# EAGLE design cc2540 (EAGLE 6.5.0)
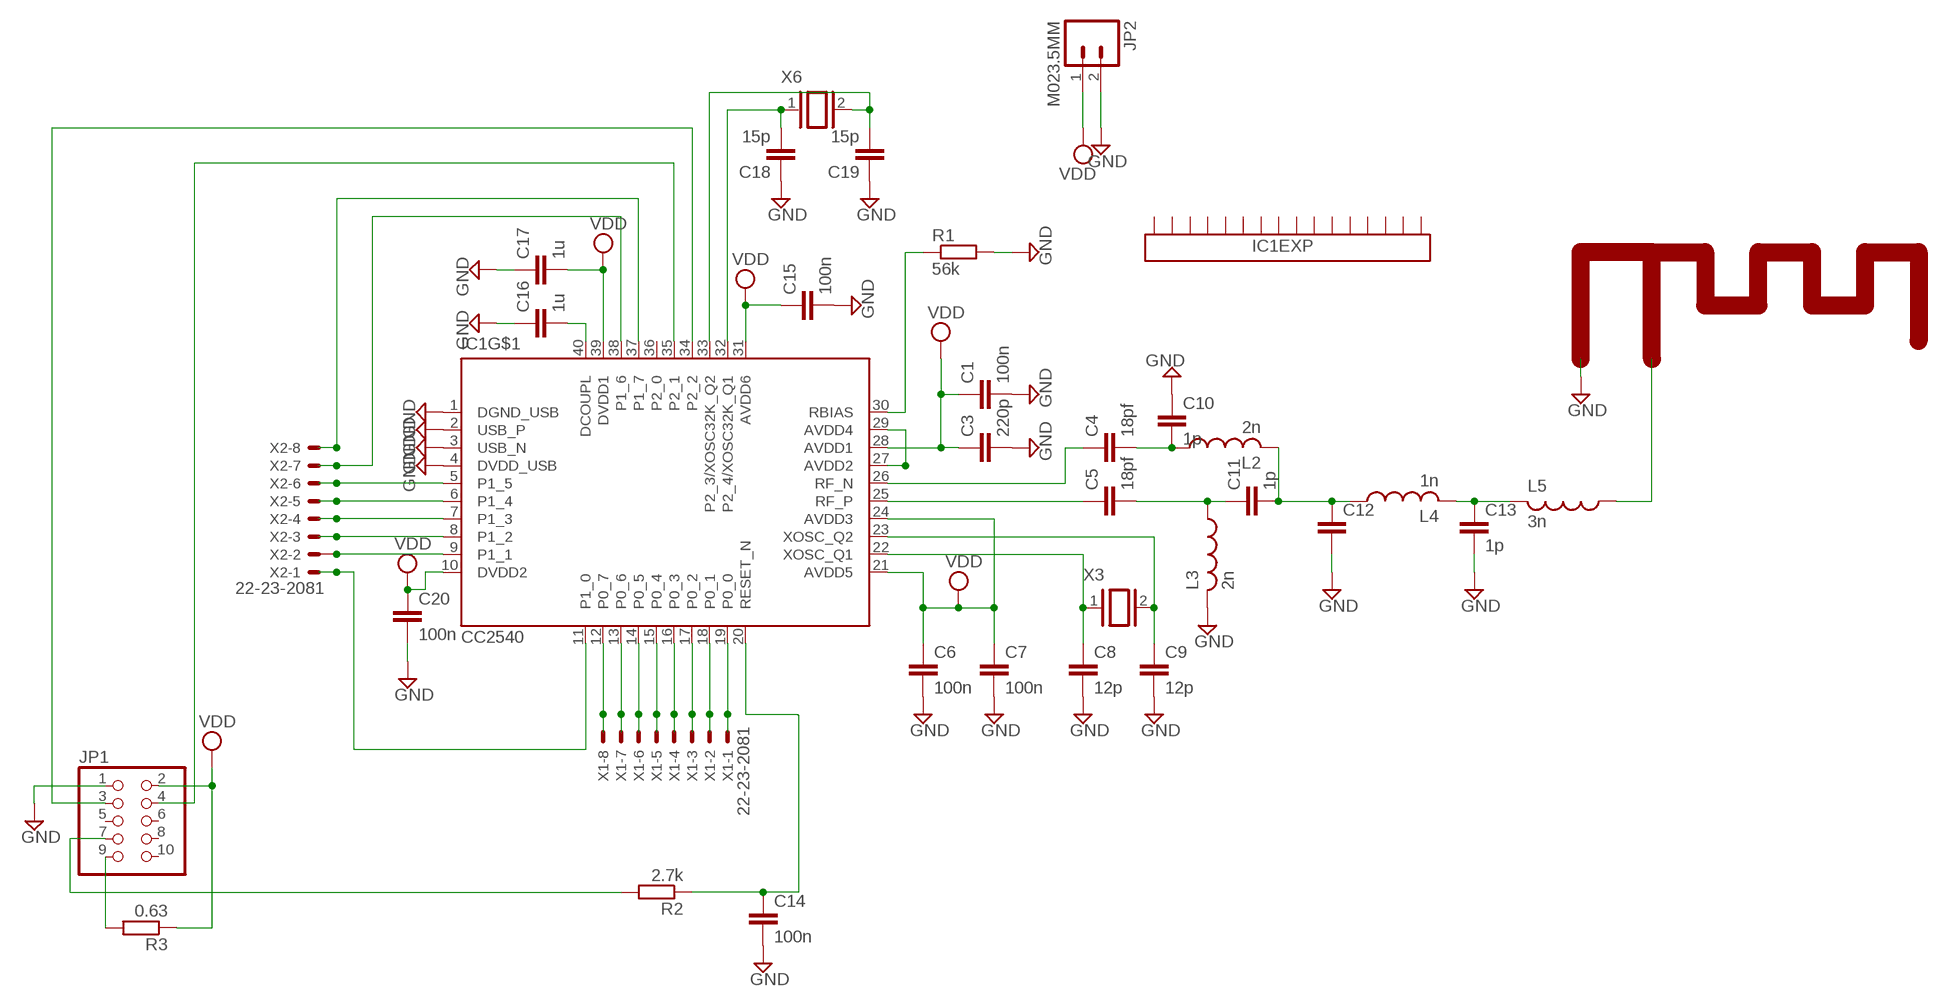
[diagram p0: schematic, sheet 1]

## Parts
A1  TI_2.4GHZ_MIFALEFT  [TI_2.4GHZ_MIFA_LEFT]
C1  100n  C-EU025-025X050  [C025-025X050]
C3  220p  C-EU025-025X050  [C025-025X050]
C4  18pf  C-EU025-025X050  [C025-025X050]
C5  18pf  C-EU025-025X050  [C025-025X050]
C6  100n  C-EU025-025X050  [C025-025X050]
C7  100n  C-EU025-025X050  [C025-025X050]
C8  12p  C-EU025-025X050  [C025-025X050]
C9  12p  C-EU025-025X050  [C025-025X050]
C10  1p  C-EU025-025X050  [C025-025X050]
C11  1p  C-EU025-025X050  [C025-025X050]
C12  C-EU025-025X050  [C025-025X050]
C13  1p  C-EU025-025X050  [C025-025X050]
C14  100n  C-EU025-025X050  [C025-025X050]
C15  100n  C-EU025-025X050  [C025-025X050]
C16  1u  C-EU025-025X050  [C025-025X050]
C17  1u  C-EU025-025X050  [C025-025X050]
C18  15p  C-EU025-025X050  [C025-025X050]
C19  15p  C-EU025-025X050  [C025-025X050]
C20  100n  C-EU025-025X050  [C025-025X050]
IC1  CC2540  [QFN40-6X6]
JP1  PINHD-2X51.27_SMD  [2X05_1.27_SMD]
JP2  M023.5MM  [SCREWTERMINAL-3.5MM-2]
L2  2n  L-US0204/5  [0204/5]
L3  2n  L-US0204/5  [0204/5]
L4  1n  L-US0204/5  [0204/5]
L5  3n  L-US0204/5  [0204/5]
R1  56k  R-EU_0204/2V  [0204V]
R2  2.7k  R-EU_0204/2V  [0204V]
R3  0.63  R-EU_0204/2V  [0204V]
X1  22-23-2081  [22-23-2081]
X2  22-23-2081  [22-23-2081]
X3  XTAL/S  [QS]
X6  XTAL/S  [QS]

## Nets
GND: A1.GND C1.2 C3.2 C6.2 C7.2 C8.2 C9.2 C10.1 C12.2 C13.2 C14.2 C15.2 C16.1 C17.1 C18.1 C19.1 C20.2 IC1.1(DGND_USB) IC1.2(USB_P) IC1.3(USB_N) IC1.4(DVDD_USB) JP1.1 JP2.2 L3.2 R1.2
N$1: IC1.30(RBIAS) R1.1
N$2: C4.1 IC1.26(RF_N)
N$3: C5.1 IC1.25(RF_P)
N$4: C8.1 IC1.22(XOSC_Q1) X3.1
N$5: C9.1 IC1.23(XOSC_Q2) X3.2
N$6: C4.2 C10.2 L2.1
N$7: C5.2 C11.1 L3.1
N$8: C11.2 C12.1 L2.2 L4.1
N$9: C13.1 L4.2 L5.2
N$10: IC1.19(P0_0) X1.1
N$11: IC1.18(P0_1) X1.2
N$12: IC1.17(P0_2) X1.3
N$13: IC1.16(P0_3) X1.4
N$14: IC1.15(P0_4) X1.5
N$15: IC1.14(P0_5) X1.6
N$16: IC1.13(P0_6) X1.7
N$17: IC1.12(P0_7) X1.8
N$18: IC1.27(AVDD2) IC1.29(AVDD4)
N$19: IC1.9(P1_1) X2.2
N$20: IC1.8(P1_2) X2.3
N$21: IC1.7(P1_3) X2.4
N$22: IC1.6(P1_4) X2.5
N$23: IC1.5(P1_5) X2.6
N$24: IC1.38(P1_6) X2.7
N$29: C19.2 IC1.33(P2_3/XOSC32K_Q2) X6.2
N$30: C18.2 IC1.32(P2_4/XOSC32K_Q1) X6.1
N$31: C14.1 IC1.20(RESET_N) R2.1
N$32: IC1.37(P1_7) X2.8
N$34: C16.2 IC1.40(DCOUPL)
N$35: A1.FEED L5.1
N$36: JP1.7 R2.2
N$37: JP1.9 R3.2
N$38: IC1.34(P2_2) JP1.3
N$39: IC1.35(P2_1) JP1.4
N$40: IC1.11(P1_0) X2.1
VDD: C1.1 C3.1 C6.1 C7.1 C15.1 C17.2 C20.1 IC1.10(DVDD2) IC1.21(AVDD5) IC1.24(AVDD3) IC1.28(AVDD1) IC1.31(AVDD6) IC1.39(DVDD1) JP1.2 JP2.1 R3.1
Unconnected: IC1.36(P2_0) IC1.EXP@1(EXP:EXP16) IC1.EXP@2(EXP:EXP16) IC1.EXP@3(EXP:EXP16) IC1.EXP@4(EXP:EXP16) IC1.EXP@5(EXP:EXP16) IC1.EXP@6(EXP:EXP16) IC1.EXP@7(EXP:EXP16) IC1.EXP@8(EXP:EXP16) IC1.EXP@9(EXP:EXP16) IC1.EXP@10(EXP:EXP16) IC1.EXP@11(EXP:EXP16) IC1.EXP@12(EXP:EXP16) IC1.EXP@13(EXP:EXP16) IC1.EXP@14(EXP:EXP16) IC1.EXP@15(EXP:EXP16) IC1.EXP@16(EXP:EXP16) JP1.5 JP1.6 JP1.8 JP1.10

## Library data of the parts
A1 = antennas:TI_2.4GHZ_MIFA
C1 C3-C20 = resistor:C-EU: CAPACITOR, European symbol
IC1 = texas:CC2540: 2.4-GHz Bluetooth® low energy System-on-Chip Auto generated by make-symbol-device-package-bsdl.ulp Rev. 39 Source: cc2540.txt
JP1 = pinhead:PINHD-2X5: PIN HEADER
JP2 = SparkFun-Connectors:M02: Standard 2-pin 0.1" header. Use with - straight break away headers ( PRT-00116) - right angle break away headers (PRT-00553) - swiss pins (PRT-00743) - machine pins (PRT-00117) - female headers (PRT-00115) Molex polarized connector foot print use with: PRT-08233 with associated crimp pins and housings. 2.54_SCREWTERM for use with PRT-10571. 3.5mm Screw Terminal footprints for PRT-08084 5mm Screw Terminal footprints for use with PRT-08433
L2-L5 = resistor:L-US: INDUCTOR, American symbol
R1-R3 = resistor:R-EU_: RESISTOR, European symbol
X1 X2 = con-molex:22-23-2081: .100" (2.54mm) Center Header - 8 Pin; MF: MOLEX; MPN: 22-23-2081; OC_FARNELL: 1756826; OC_NEWARK: 01C7592
X3 X6 = special:XTAL/S: CRYSTAL

## Board
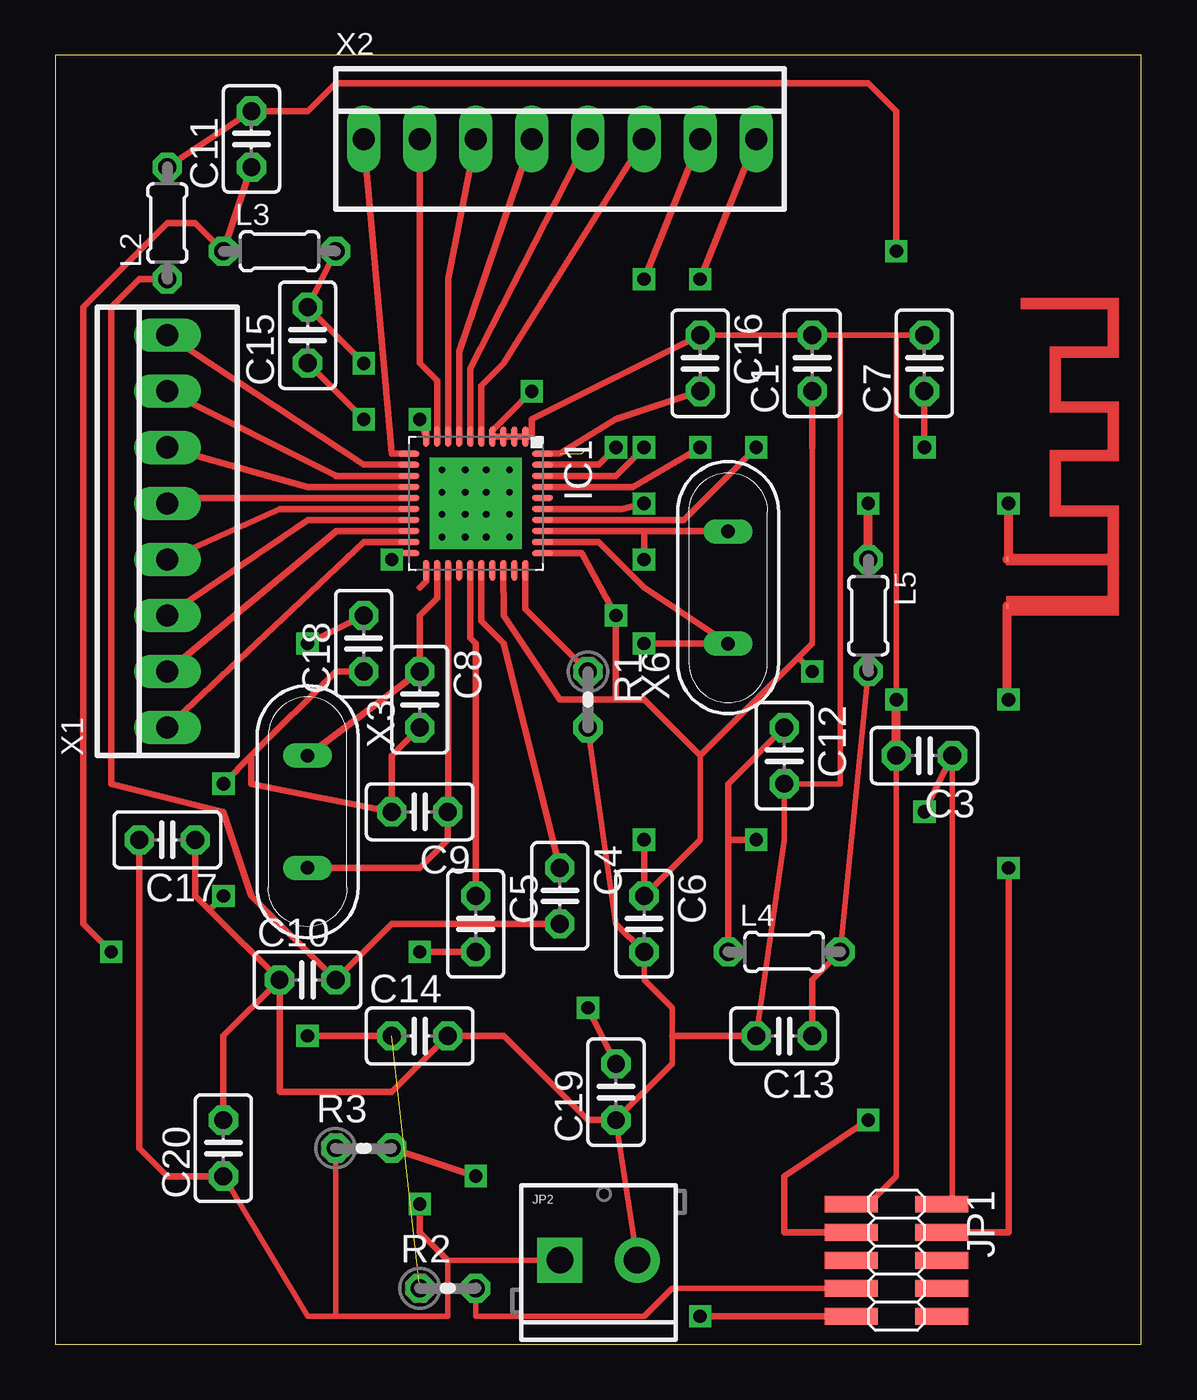
[diagram p1: board, top side]
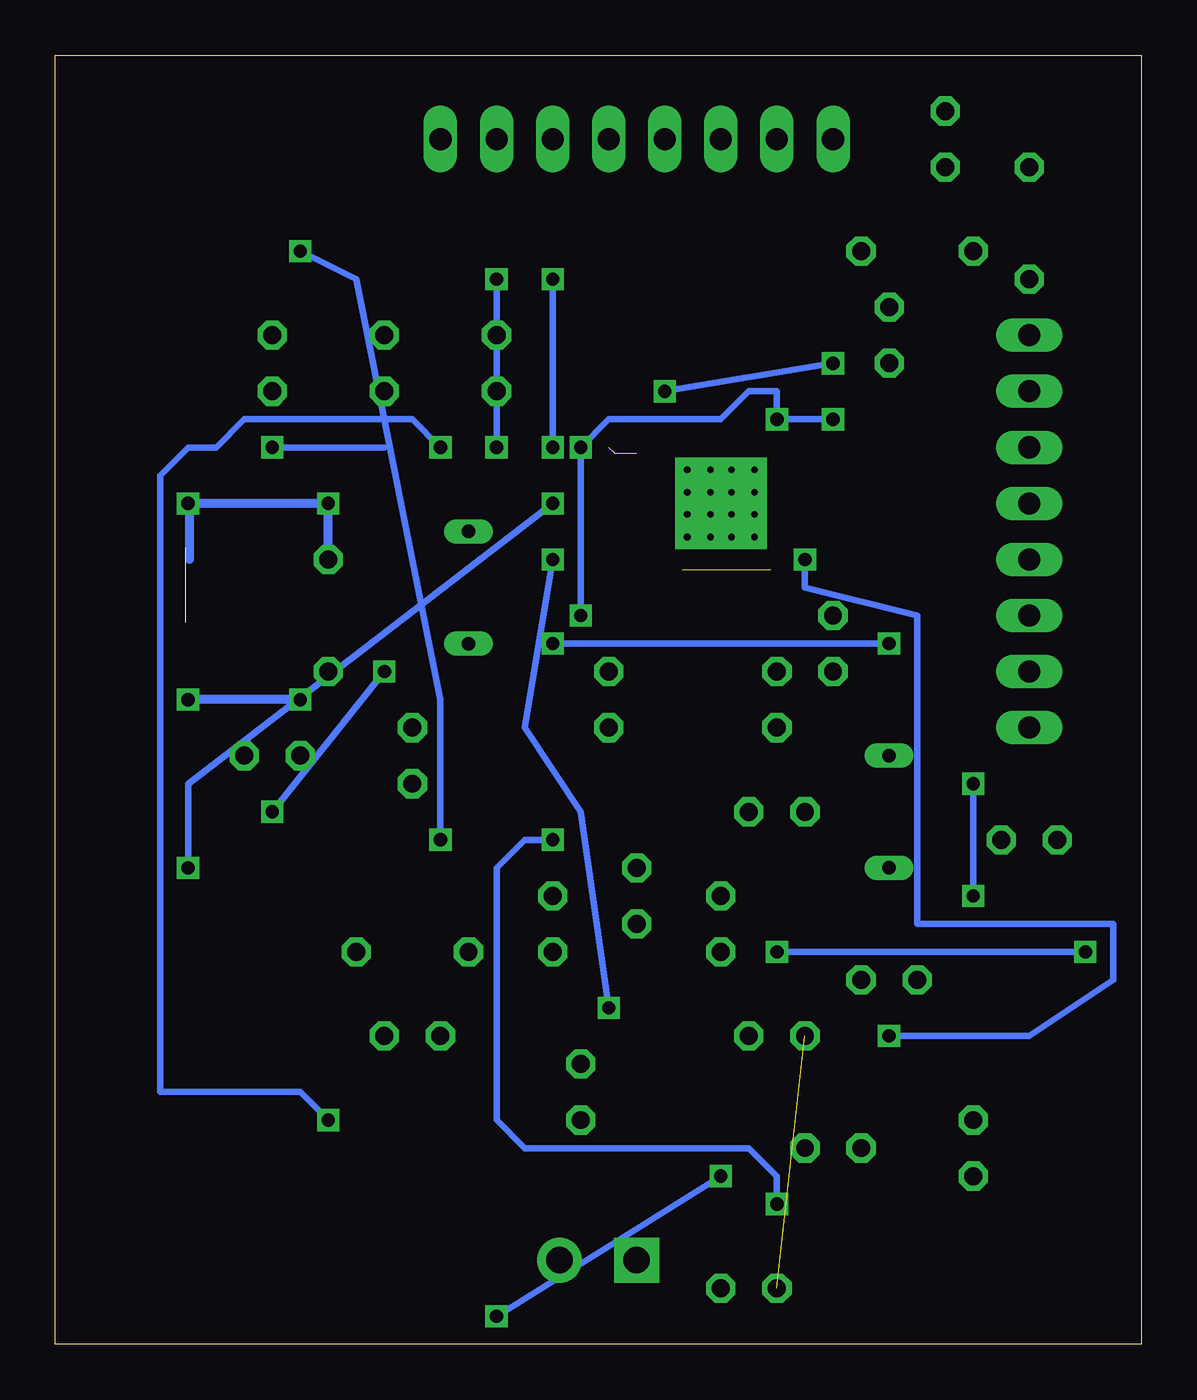
[diagram p2: board, bottom side, seen from below]

Size 49.2 x 58.41 mm. Coordinates in mm from the lower left corner, seen from the top.
Outline: 0,0 49.2,0 49.2,58.41 0,58.41 0,0
Copper layers (1*16): Top 0.035mm / dielectric 1.5mm / Bottom 0.035mm
Design rules "default": minimum track width 10mil, minimum drill 24mil, track to track 8mil, track to pad 8mil, pad to pad 8mil, via to via 8mil, smd to smd 8mil, copper to edge 40mil, drill to drill 8mil, minimum pad ring 10mil, minimum via ring 8mil, stop-mask expansion 4mil, vias tented up to drill 0mil, thermal gap 10mil

### Footprints (pad centres in the part's own frame; a part is rotated, then mirrored left to right if it is on the bottom)
TI_2.4GHZ_MIFA_LEFT = smd 0.2 x 0.1: FEED 0,-0.06; GND 2.1,-0.06
C025-025X050 = drill 0.813 octagon: 1 -1.27,0; 2 1.27,0
QFN40-6X6 = smd 0.95 x 0.28: 1 -3.025,2.25; 2 -3.025,1.75; 3 -3.025,1.25; 4 -3.025,0.75; 5 -3.025,0.25; 6 -3.025,-0.25; 7 -3.025,-0.75; 8 -3.025,-1.25; 9 -3.025,-1.75; 10 -3.025,-2.25; 21 3.025,-2.25; 22 3.025,-1.75; 23 3.025,-1.25; 24 3.025,-0.75; 25 3.025,-0.25; 26 3.025,0.25; 27 3.025,0.75; 28 3.025,1.25; 29 3.025,1.75; 30 3.025,2.25 | smd 0.28 x 0.95: 11 -2.25,-3.025; 12 -1.75,-3.025; 13 -1.25,-3.025; 14 -0.75,-3.025; 15 -0.25,-3.025; 16 0.25,-3.025; 17 0.75,-3.025; 18 1.25,-3.025; 19 1.75,-3.025; 20 2.25,-3.025; 31 2.25,3.025; 32 1.75,3.025; 33 1.25,3.025; 34 0.75,3.025; 35 0.25,3.025; 36 -0.25,3.025; 37 -0.75,3.025; 38 -1.25,3.025; 39 -1.75,3.025; 40 -2.25,3.025 | drill 0.3 pad 1.1 square: EXP@1 -1.525,1.525; EXP@2 -0.5,1.525; EXP@3 0.5,1.525; EXP@4 1.525,1.525; EXP@5 -1.525,0.475; EXP@6 -0.5,0.475; EXP@7 0.5,0.475; EXP@8 1.525,0.475; EXP@9 -1.525,-0.475; EXP@10 -0.5,-0.475; EXP@11 0.5,-0.475; EXP@12 1.525,-0.475; EXP@13 -1.525,-1.525; EXP@14 -0.5,-1.525; EXP@15 0.5,-1.525; EXP@16 1.525,-1.525
2X05_1.27_SMD = smd 0.76 x 2.4: 1 -2.54,-2.05; 2 -2.54,2.05; 3 -1.27,-2.05; 4 -1.27,2.05; 5 0,-2.05; 6 0,2.05; 7 1.27,-2.05; 8 1.27,2.05; 9 2.54,-2.05; 10 2.54,2.05
SCREWTERMINAL-3.5MM-2 = drill 1.2 pad 2.032 square: 1 0,0 | drill 1.2 pad 2.032: 2 3.5,0
0204/5 = drill 0.813 octagon: 1 -2.54,0; 2 2.54,0
0204V = drill 0.813 octagon: 1 -1.27,0; 2 1.27,0
22-23-2081 = drill 1 long: 1 -8.89,0; 2 -6.35,0; 3 -3.81,0; 4 -1.27,0; 5 1.27,0; 6 3.81,0; 7 6.35,0; 8 8.89,0
QS = drill 0.61 long: 1 -2.54,0; 2 2.54,0

### Placement (x,y rotation side)
A1  43.18,35.56 270 top
C1  34.29,44.45 90 top
C3  39.37,26.67 180 top
C4  22.86,20.32 270 top
C5  19.05,19.05 270 top
C6  26.67,19.05 270 top
C7  39.37,44.45 90 top
C8  16.51,29.21 270 top
C9  16.51,24.13 180 top
C10  11.43,16.51 0 top
C11  8.89,54.61 90 top
C12  33.02,26.67 270 top
C13  33.02,13.97 180 top
C14  16.51,13.97 0 top
C15  11.43,45.72 90 top
C16  29.21,44.45 270 top
C17  5.08,22.86 180 top
C18  13.97,31.75 90 top
C19  25.4,11.43 90 top
C20  7.62,8.89 90 top
IC1  19.05,38.1 270 top
JP1  38.1,3.81 270 top
JP2  22.86,3.81 0 top
L2  5.08,50.8 90 top
L3  10.16,49.53 0 top
L4  33.02,17.78 0 top
L5  36.83,33.02 270 top
R1  24.13,29.21 270 top
R2  17.78,2.54 0 top
R3  13.97,8.89 0 top
X1  5.08,36.83 90 top
X2  22.86,54.61 0 top
X3  11.43,24.13 270 top
X6  30.48,34.29 90 top

### Tracks (layer width: path | path; a pad name or v marks a point on that pad's centre or on a via)
GND  (via drill 0.6)
  Top 0.254: JP2.2 C19.1 27.94,12.7 27.94,13.97 27.94,15.24 26.67,16.51 C6.2 25.4,19.05 R1.2 | C13.2 33.02,22.86 C12.2 35.56,25.4 35.56,45.72 | C16.1 C1.2 35.56,45.72 | 35.56,45.72 38.1,45.72 | 38.1,45.72 C7.2 | C3.2 38.1,7.62 36.83,6.35 JP1.1 | v38.1,29.21 38.1,45.72
  Top 0.305: IC1.2 IC1.1 | IC1.2 21.59,41.12 21.59,41.91 C16.1 | IC1.2 IC1.3 IC1.4 19.8,41.39 v21.59,43.18 | v13.97,44.45 C15.2 L3.2 | C13.2 27.94,13.97 | C17.1 6.35,20.32 6.99,19.68 | 6.99,19.68 C10.1 | C20.2 7.62,13.97 C10.1 | C10.1 10.16,11.43 15.24,11.43 C14.2 20.32,13.97 24.13,10.16 C19.1 | C8.2 15.24,26.67 C9.2 8.89,25.4 8.89,26.67 | C18.1 12.7,30.48 8.89,26.67 | 8.89,26.67 v7.62,25.4 | v7.62,20.32 6.99,19.68
  Top 0.406: C3.2 v38.1,29.21 | v43.18,29.21 43.12,29.21 A1.GND
  Bottom 0.305: v21.59,43.18 v13.97,44.45 | v7.62,25.4 v7.62,20.32
  Bottom 0.406: v38.1,29.21 v43.18,29.21
N$1
  Top 0.305: IC1.30 21.3,33.31 R1.1
N$2
  Top 0.305: IC1.26 19.3,32.77 20.32,31.75 C4.1
N$3
  Top 0.305: IC1.25 18.8,32 19.05,31.75 C5.1
N$4
  Top 0.305: IC1.22 17.3,33.81 16.51,33.02 C8.1 X3.1
N$5
  Top 0.305: IC1.23 17.8,24.15 C9.1 17.78,22.86 16.51,21.59 X3.2
N$6
  Top 0.305: C4.2 15.24,19.05 C10.2 8.89,20.32 7.62,24.13 2.54,25.4 2.54,46.99 3.81,48.26 L2.1
N$7  (via drill 0.6)
  Top 0.305: C11.1 L3.1 6.35,50.8 5.08,50.8 1.27,46.99 1.27,19.05 v2.54,17.78 | v16.51,17.78 C5.2
  Bottom 0.305: v2.54,17.78 v16.51,17.78
N$8  (via drill 0.6)
  Top 0.305: L2.2 C11.2 11.43,55.88 12.7,57.15 36.83,57.15 38.1,55.88 v38.1,49.53 | L4.1 30.48,22.86 | 30.48,22.86 30.48,25.4 C12.1 | v31.75,22.86 30.48,22.86
  Bottom 0.305: v38.1,49.53 35.56,48.26 31.75,29.21 v31.75,22.86
N$9
  Top 0.254: L4.2 L5.2
  Top 0.305: C13.1 34.29,16.51 L4.2
N$10
  Top 0.305: IC1.19 13.97,36.35 X1.1
N$11
  Top 0.305: IC1.18 12.7,36.85 12.7,36.83 X1.2
N$12
  Top 0.305: IC1.17 11.43,37.35 X1.3
N$13
  Top 0.305: IC1.16 10.16,37.85 X1.4
N$14
  Top 0.305: IC1.15 5.08,38.35 X1.5
N$15
  Top 0.305: IC1.14 11.43,38.85 X1.6
N$16
  Top 0.305: IC1.13 12.7,39.35 12.7,39.37 X1.7
N$17
  Top 0.305: IC1.12 13.97,39.85 X1.8
N$18  (1 unrouted)
N$19
  Top 0.305: IC1.9 17.3,43.66 16.51,44.45 X2.2
N$20
  Top 0.305: IC1.8 17.8,48.28 X2.3
N$21
  Top 0.305: IC1.7 18.3,44.97 X2.4
N$22
  Top 0.305: IC1.6 18.8,44.2 X2.5
N$23
  Top 0.305: IC1.5 19.3,43.43 20.32,44.45 X2.6
N$24  (via drill 0.6)
  Top 0.305: IC1.38 25.38,39.35 v26.67,40.64 | v26.67,48.26 X2.7
  Bottom 0.305: v26.67,40.64 v26.67,48.26
N$25  (via drill 0.6)
  Bottom 0.406: v36.83,38.1 v43.18,38.1
N$29  (via drill 0.6)
  Top 0.305: X6.2 30.46,36.85 IC1.33 26.67,36.83 v26.67,35.56 | v24.13,15.24 C19.2
  Bottom 0.305: v26.67,35.56 27.94,27.94 25.4,24.13 v24.13,15.24
N$30  (via drill 0.6)
  Top 0.305: IC1.32 24.61,36.35 26.67,34.29 X6.1 v26.67,31.75 | C18.2 v11.43,31.75
  Bottom 0.305: v11.43,31.75 v26.67,31.75
N$31  (via drill 0.6)  (1 unrouted)
  Top 0.305: IC1.20 15.53,35.85 v15.24,35.56 | v11.43,13.97 C14.1
  Bottom 0.305: v15.24,35.56 15.24,34.29 10.16,33.02 10.16,19.05 1.27,19.05 1.27,16.51 5.08,13.97 v11.43,13.97
N$32  (via drill 0.6)
  Top 0.305: IC1.37 26.15,38.85 v29.21,40.64 | v29.21,48.26 X2.8
  Bottom 0.305: v29.21,40.64 v29.21,48.26
N$34  (2 unrouted)
  Top 0.305: IC1.40 22.86,40.35 25.4,41.91 C16.2
N$35  (1 unrouted)
  Top 0.406: L5.1 36.83,38.1 | A1.FEED 43.18,35.56 43.18,38.1
  Bottom 0.406: L5.1 36.83,38.1 43.12,38.1 | 43.18,38.1 43.12,38.1 | 43.12,38.1 A1.FEED
N$36
  Top 0.254: JP1.7 27.94,2.54 26.67,1.27 19.05,1.27 R2.2
N$37  (via drill 0.6)
  Top 0.305: JP1.9 v29.21,1.27 | v19.05,7.62 R3.2
  Bottom 0.305: v29.21,1.27 v19.05,7.62
N$38  (via drill 0.6)
  Top 0.305: JP1.3 33.02,5.08 33.02,7.62 v36.83,10.16 | IC1.34 28.46,37.35 v31.75,40.64
  Bottom 0.305: v31.75,40.64 33.02,41.91 40.64,41.91 41.91,40.64 43.18,40.64 44.45,39.37 44.45,11.43 38.1,11.43 v36.83,10.16
N$39  (via drill 0.6)
  Top 0.305: IC1.35 25.65,37.85 v26.67,38.1 | v43.18,21.59 43.18,5.08 JP1.4
  Bottom 0.305: v26.67,38.1 43.18,25.4 v43.18,21.59
N$40
  Top 0.305: IC1.11 15.24,40.35 X2.1
VDD  (via drill 0.6)  (3 unrouted)
  Top 0.254: C6.1 29.21,22.86 29.21,26.67 33.65,31.11 34.29,31.75 34.29,40.64 | JP2.1 17.78,3.81 17.78,1.27 12.7,1.27 | 12.7,1.27 11.43,1.27 7.96,7.06 C20.1 | C3.1 40.64,6.35 JP1.2 | 12.7,1.27 R3.1
  Top 0.305: IC1.39 24.61,39.85 v25.4,40.64 | IC1.31 23.84,35.85 v25.4,33.02 25.4,29.21 | IC1.21 16.8,34.58 16.51,34.29 | C3.1 v39.37,24.13 | v34.29,30.48 33.65,31.11 | v13.97,41.91 C15.1 | C17.2 3.81,8.89 5.08,7.62 7.4,7.62 7.96,7.06 | C7.1 v39.37,40.64 | 34.29,40.64 C1.1 | IC1.28 20.32,33.02 22.86,29.21 25.4,29.21 | 25.4,29.21 26.67,29.21 29.21,26.67 | C6.1 v26.67,22.86 | v16.51,6.35 16.51,5.08 17.78,3.81 | IC1.10 16.8,41.62 v16.51,41.91 IC1.10
  Bottom 0.305: v25.4,33.02 v25.4,40.64 24.13,41.91 19.05,41.91 17.78,43.18 16.51,43.18 v16.51,41.91 v13.97,41.91 | v39.37,24.13 v34.29,30.48 | v39.37,40.64 34.29,40.64 | v26.67,22.86 27.94,22.86 29.21,21.59 29.21,10.16 27.94,8.89 17.78,8.89 16.51,7.62 v16.51,6.35